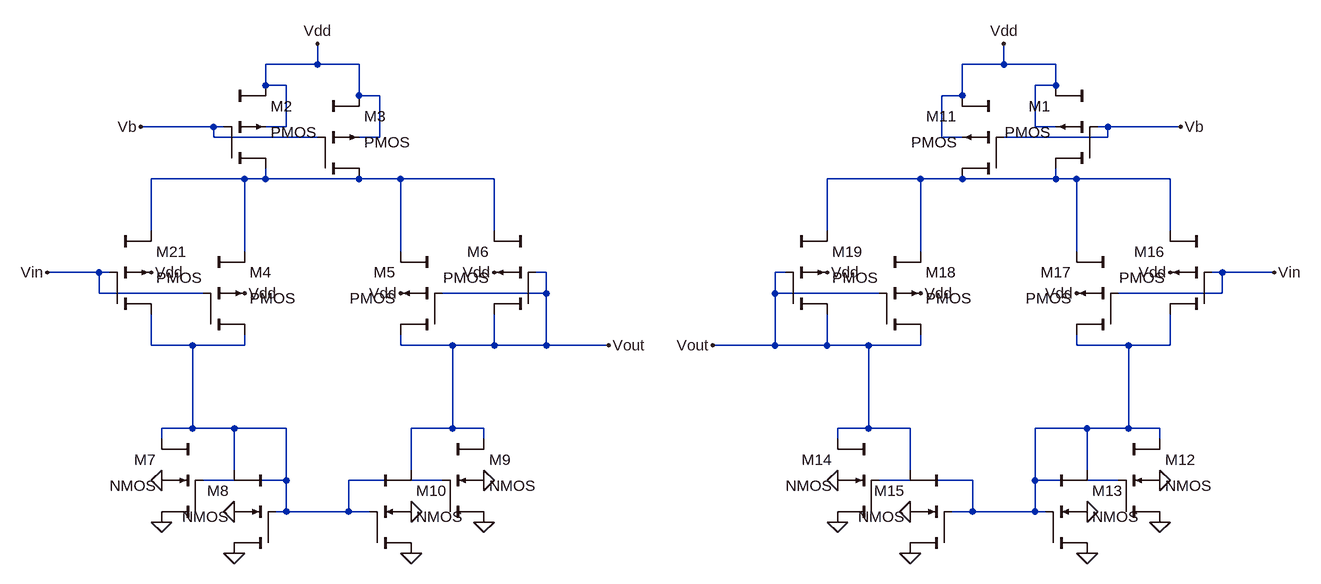
[diagram p0: schematic diffamp.asc]
diffamp.asc, the LTspice schematic file:
Version 4
SHEET 1 1840 1588
WIRE 288 816 288 784
WIRE 288 816 208 816
WIRE 352 816 288 816
WIRE 1344 816 1344 784
WIRE 1344 816 1280 816
WIRE 1424 816 1344 816
WIRE 208 848 208 816
WIRE 240 848 208 848
WIRE 1424 848 1424 816
WIRE 1424 848 1392 848
WIRE 352 864 352 816
WIRE 384 864 352 864
WIRE 1280 864 1280 816
WIRE 1280 864 1248 864
WIRE 128 912 16 912
WIRE 144 912 128 912
WIRE 240 912 240 848
WIRE 240 912 208 912
WIRE 1392 912 1392 848
WIRE 1424 912 1392 912
WIRE 1504 912 1488 912
WIRE 1616 912 1504 912
WIRE 128 928 128 912
WIRE 288 928 128 928
WIRE 384 928 384 864
WIRE 384 928 352 928
WIRE 1248 928 1248 864
WIRE 1280 928 1248 928
WIRE 1504 928 1504 912
WIRE 1504 928 1344 928
WIRE 176 992 32 992
WIRE 208 992 208 976
WIRE 208 992 176 992
WIRE 352 992 208 992
WIRE 416 992 352 992
WIRE 560 992 416 992
WIRE 1216 992 1072 992
WIRE 1280 992 1216 992
WIRE 1424 992 1424 976
WIRE 1424 992 1280 992
WIRE 1456 992 1424 992
WIRE 1600 992 1456 992
WIRE 32 1072 32 992
WIRE 560 1072 560 992
WIRE 1072 1072 1072 992
WIRE 1600 1072 1600 992
WIRE 176 1104 176 992
WIRE 416 1104 416 992
WIRE 1216 1104 1216 992
WIRE 1456 1104 1456 992
WIRE -48 1136 -128 1136
WIRE -32 1136 -48 1136
WIRE 640 1136 624 1136
WIRE 1008 1136 992 1136
WIRE 1680 1136 1664 1136
WIRE 1760 1136 1680 1136
WIRE -48 1168 -48 1136
WIRE 112 1168 -48 1168
WIRE 640 1168 640 1136
WIRE 640 1168 480 1168
WIRE 992 1168 992 1136
WIRE 1152 1168 992 1168
WIRE 1680 1168 1680 1136
WIRE 1680 1168 1520 1168
WIRE 32 1248 32 1200
WIRE 96 1248 32 1248
WIRE 176 1248 176 1232
WIRE 176 1248 96 1248
WIRE 416 1248 416 1232
WIRE 496 1248 416 1248
WIRE 560 1248 560 1200
WIRE 560 1248 496 1248
WIRE 640 1248 640 1168
WIRE 640 1248 560 1248
WIRE 736 1248 640 1248
WIRE 992 1248 992 1168
WIRE 992 1248 896 1248
WIRE 1072 1248 1072 1200
WIRE 1072 1248 992 1248
WIRE 1136 1248 1072 1248
WIRE 1216 1248 1216 1232
WIRE 1216 1248 1136 1248
WIRE 1456 1248 1456 1232
WIRE 1536 1248 1456 1248
WIRE 1600 1248 1600 1200
WIRE 1600 1248 1536 1248
WIRE 96 1376 96 1248
WIRE 96 1376 48 1376
WIRE 160 1376 96 1376
WIRE 240 1376 160 1376
WIRE 496 1376 496 1248
WIRE 496 1376 432 1376
WIRE 544 1376 496 1376
WIRE 1136 1376 1136 1248
WIRE 1136 1376 1088 1376
WIRE 1200 1376 1136 1376
WIRE 1472 1376 1392 1376
WIRE 1536 1376 1536 1248
WIRE 1536 1376 1472 1376
WIRE 1584 1376 1536 1376
WIRE 48 1392 48 1376
WIRE 544 1392 544 1376
WIRE 1088 1392 1088 1376
WIRE 1584 1392 1584 1376
WIRE 160 1440 160 1376
WIRE 432 1440 432 1376
WIRE 1200 1440 1200 1376
WIRE 1472 1440 1472 1376
WIRE 240 1456 240 1376
WIRE 240 1456 112 1456
WIRE 480 1456 336 1456
WIRE 1296 1456 1152 1456
WIRE 1392 1456 1392 1376
WIRE 1520 1456 1392 1456
WIRE 240 1504 240 1456
WIRE 240 1504 224 1504
WIRE 336 1504 336 1456
WIRE 336 1504 240 1504
WIRE 368 1504 336 1504
WIRE 1296 1504 1296 1456
WIRE 1296 1504 1264 1504
WIRE 1392 1504 1392 1456
WIRE 1392 1504 1296 1504
WIRE 1408 1504 1392 1504
FLAG 16 912 Vb
FLAG 288 784 Vdd
FLAG 48 1456 0
FLAG 160 1504 0
FLAG 544 1456 0
FLAG 432 1504 0
FLAG 160 1568 0
FLAG 48 1520 0
FLAG 432 1568 0
FLAG 544 1520 0
FLAG -128 1136 Vin
FLAG 736 1248 Vout
FLAG 560 1136 Vdd
FLAG 416 1168 Vdd
FLAG 176 1168 Vdd
FLAG 32 1136 Vdd
FLAG 1616 912 Vb
FLAG 1344 784 Vdd
FLAG 1584 1456 0
FLAG 1472 1504 0
FLAG 1088 1456 0
FLAG 1200 1504 0
FLAG 1472 1568 0
FLAG 1584 1520 0
FLAG 1200 1568 0
FLAG 1088 1520 0
FLAG 1760 1136 Vin
FLAG 896 1248 Vout
FLAG 1072 1136 Vdd
FLAG 1216 1168 Vdd
FLAG 1456 1168 Vdd
FLAG 1600 1136 Vdd
SYMBOL cktsym\\pmos4 208 912 R0
SYMATTR InstName M2
SYMATTR SpiceModel ""
SYMATTR Value2 l=1.2u w=6u
SYMATTR SpiceLine ""
SYMATTR SpiceLine2 ""
SYMBOL cktsym\\pmos4 352 928 R0
SYMATTR InstName M3
SYMATTR SpiceModel ""
SYMATTR Value2 l=1.2u w=6u
SYMATTR SpiceLine ""
SYMATTR SpiceLine2 ""
SYMBOL cktsym\\nmos4 48 1456 M0
SYMATTR InstName M7
SYMATTR SpiceModel ""
SYMATTR Value2 l=1.2u w=6u
SYMATTR SpiceLine ""
SYMATTR SpiceLine2 ""
SYMBOL cktsym\\nmos4 160 1504 M0
SYMATTR InstName M8
SYMATTR SpiceModel ""
SYMATTR Value2 l=1.2u w=6u
SYMATTR SpiceLine ""
SYMATTR SpiceLine2 ""
SYMBOL cktsym\\nmos4 544 1456 R0
SYMATTR InstName M9
SYMATTR SpiceModel ""
SYMATTR Value2 l=1.2u w=6u
SYMATTR SpiceLine ""
SYMATTR SpiceLine2 ""
SYMBOL cktsym\\nmos4 432 1504 R0
SYMATTR InstName M10
SYMATTR SpiceModel ""
SYMATTR Value2 l=1.2u w=6u
SYMATTR SpiceLine ""
SYMATTR SpiceLine2 ""
SYMBOL cktsym\\pmos4 32 1136 R0
SYMATTR InstName M21
SYMATTR SpiceModel ""
SYMATTR Value2 l=1.2u w=6u
SYMATTR SpiceLine ""
SYMATTR SpiceLine2 ""
SYMBOL cktsym\\pmos4 176 1168 R0
SYMATTR InstName M4
SYMATTR SpiceModel ""
SYMATTR Value2 l=1.2u w=6u
SYMATTR SpiceLine ""
SYMATTR SpiceLine2 ""
SYMBOL cktsym\\pmos4 416 1168 M0
SYMATTR InstName M5
SYMATTR SpiceModel ""
SYMATTR Value2 l=1.2u w=6u
SYMATTR SpiceLine ""
SYMATTR SpiceLine2 ""
SYMBOL cktsym\\pmos4 560 1136 M0
SYMATTR InstName M6
SYMATTR SpiceModel ""
SYMATTR Value2 l=1.2u w=6u
SYMATTR SpiceLine ""
SYMATTR SpiceLine2 ""
SYMBOL cktsym\\pmos4 1424 912 M0
SYMATTR InstName M1
SYMATTR SpiceModel ""
SYMATTR Value2 l=1.2u w=6u
SYMATTR SpiceLine ""
SYMATTR SpiceLine2 ""
SYMBOL cktsym\\pmos4 1280 928 M0
SYMATTR InstName M11
SYMATTR SpiceModel ""
SYMATTR Value2 l=1.2u w=6u
SYMATTR SpiceLine ""
SYMATTR SpiceLine2 ""
SYMBOL cktsym\\nmos4 1584 1456 R0
SYMATTR InstName M12
SYMATTR SpiceModel ""
SYMATTR Value2 l=1.2u w=6u
SYMATTR SpiceLine ""
SYMATTR SpiceLine2 ""
SYMBOL cktsym\\nmos4 1472 1504 R0
SYMATTR InstName M13
SYMATTR SpiceModel ""
SYMATTR Value2 l=1.2u w=6u
SYMATTR SpiceLine ""
SYMATTR SpiceLine2 ""
SYMBOL cktsym\\nmos4 1088 1456 M0
SYMATTR InstName M14
SYMATTR SpiceModel ""
SYMATTR Value2 l=1.2u w=6u
SYMATTR SpiceLine ""
SYMATTR SpiceLine2 ""
SYMBOL cktsym\\nmos4 1200 1504 M0
SYMATTR InstName M15
SYMATTR SpiceModel ""
SYMATTR Value2 l=1.2u w=6u
SYMATTR SpiceLine ""
SYMATTR SpiceLine2 ""
SYMBOL cktsym\\pmos4 1600 1136 M0
SYMATTR InstName M16
SYMATTR SpiceModel ""
SYMATTR Value2 l=1.2u w=6u
SYMATTR SpiceLine ""
SYMATTR SpiceLine2 ""
SYMBOL cktsym\\pmos4 1456 1168 M0
SYMATTR InstName M17
SYMATTR SpiceModel ""
SYMATTR Value2 l=1.2u w=6u
SYMATTR SpiceLine ""
SYMATTR SpiceLine2 ""
SYMBOL cktsym\\pmos4 1216 1168 R0
SYMATTR InstName M18
SYMATTR SpiceModel ""
SYMATTR Value2 l=1.2u w=6u
SYMATTR SpiceLine ""
SYMATTR SpiceLine2 ""
SYMBOL cktsym\\pmos4 1072 1136 R0
SYMATTR InstName M19
SYMATTR SpiceModel ""
SYMATTR Value2 l=1.2u w=6u
SYMATTR SpiceLine ""
SYMATTR SpiceLine2 ""

The netlist it stands for:
* diffamp.asc
M2 N001 Vb Vdd Vdd PMOS l=1.2u w=6u
M3 N001 Vb Vdd Vdd PMOS l=1.2u w=6u
M7 N003 N003 0 0 NMOS l=1.2u w=6u
M8 N003 N003 0 0 NMOS l=1.2u w=6u
M9 Vout N003 0 0 NMOS l=1.2u w=6u
M10 Vout N003 0 0 NMOS l=1.2u w=6u
M21 N003 Vin N001 Vdd PMOS l=1.2u w=6u
M4 N003 Vin N001 Vdd PMOS l=1.2u w=6u
M5 Vout Vout N001 Vdd PMOS l=1.2u w=6u
M6 Vout Vout N001 Vdd PMOS l=1.2u w=6u
M1 N002 Vb Vdd Vdd PMOS l=1.2u w=6u
M11 N002 Vb Vdd Vdd PMOS l=1.2u w=6u
M12 N004 N004 0 0 NMOS l=1.2u w=6u
M13 N004 N004 0 0 NMOS l=1.2u w=6u
M14 Vout N004 0 0 NMOS l=1.2u w=6u
M15 Vout N004 0 0 NMOS l=1.2u w=6u
M16 N004 Vin N002 Vdd PMOS l=1.2u w=6u
M17 N004 Vin N002 Vdd PMOS l=1.2u w=6u
M18 Vout Vout N002 Vdd PMOS l=1.2u w=6u
M19 Vout Vout N002 Vdd PMOS l=1.2u w=6u
.model NMOS NMOS
.model PMOS PMOS
.lib standard.mos
.backanno
.end